# EAGLE design riffleito-REVE (EAGLE 6.5.0)
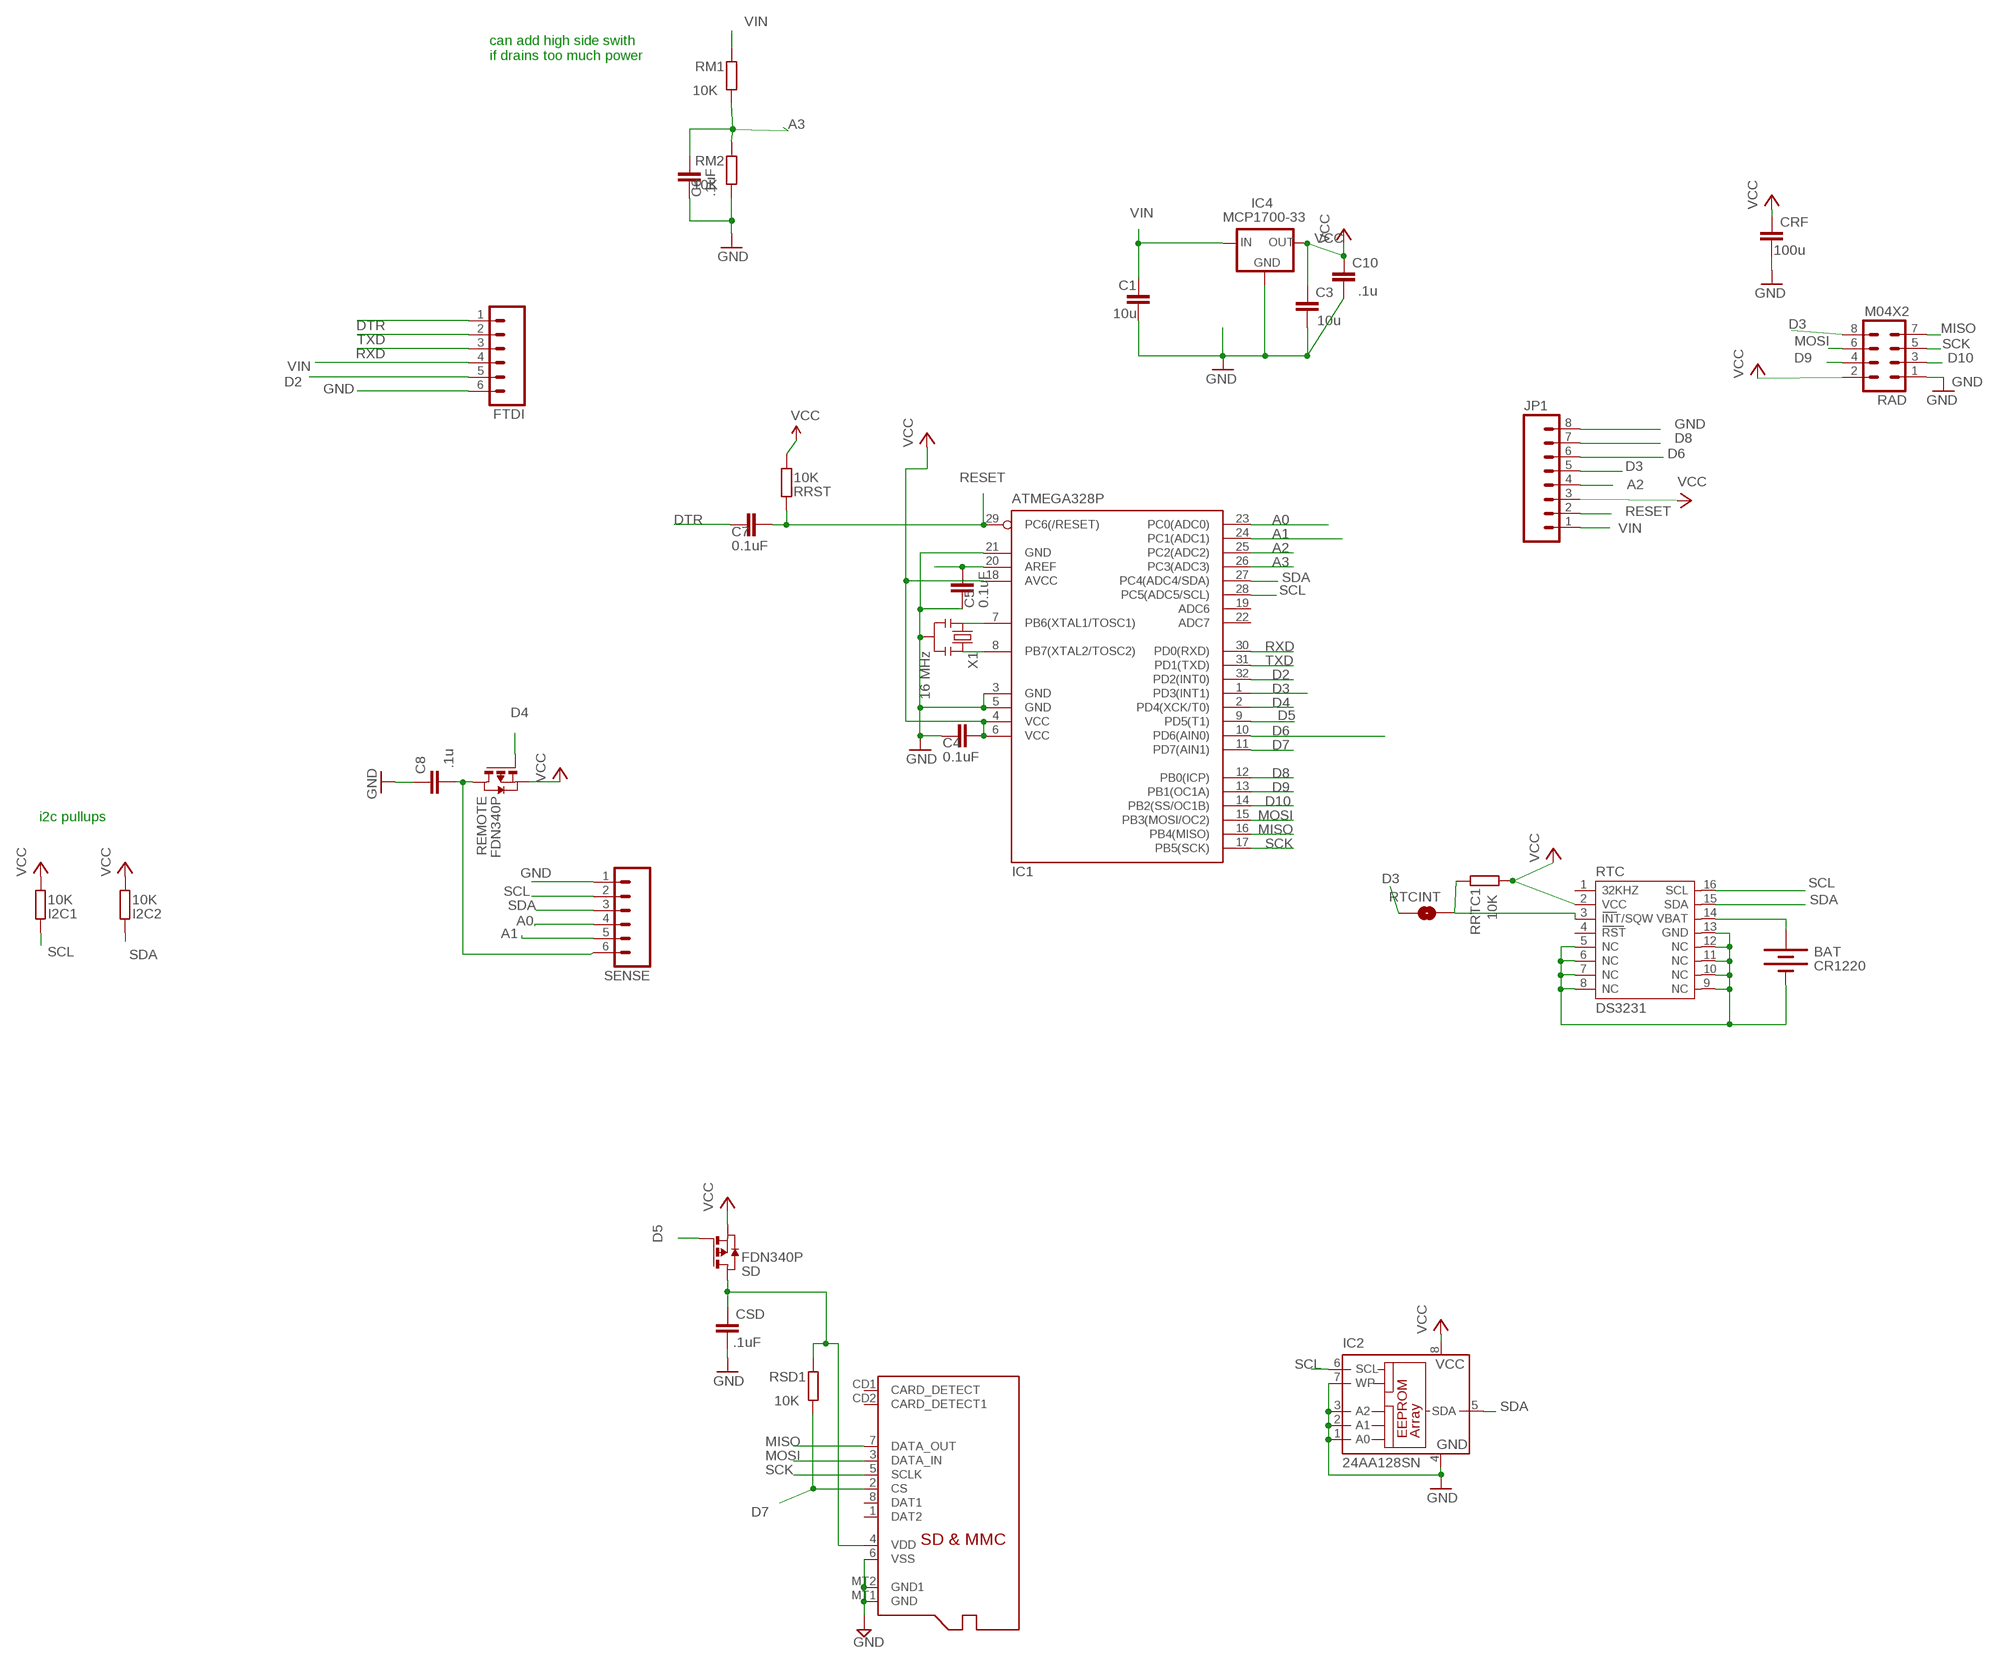
[diagram p0: schematic, sheet 1]

## Parts
BAT  CR1220  BATTERYBATTERY_12MM_SMT  [BATTCON_12MM_SMT]
C1  10u  C-EUC0805  [C0805]
C3  10u  C-EUC0805  [C0805]
C4  0.1uF  C-EUC0805  [C0805@1]
C5  0.1uF  C-EUC0805  [C0805@1]
C6  .1uF  C-EUC0805  [C0805@1]
C7  0.1uF  C-EUC0805  [C0805@1]
C8  .1u  C-EUC0805  [C0805]
C10  .1u  C-EUC0805  [C0805]
CRF  100u  C-EUC0805  [C0805]
CSD  .1uF  C-EUC0805  [C0805]
FTDI  M06SIP  [1X06]
I2C1  10K  R-EU_R0805  [R0805]
I2C2  10K  R-EU_R0805  [R0805]
IC1  ATMEGA328P  MEGA8-AI  [TQFP32-08]
IC2  24AA128SN  [SO-08]
IC4  MCP1700-33  MCP1700SOT233  [SOT23]
JP1  M081X08  [1X08]
MICROSD  MICROSD  [MICROSD]
RAD  M04X2  [2X4]
REMOTE  FDN340P  PMOSSOT23  [SOT-23]
RM1  10K  R-EU_R0805  [R0805]
RM2  10K  R-EU_R0805  [R0805]
RRST  10K  R-EU_R0805  [R0805]
RRTC1  10K  R-EU_R0805  [R0805]
RSD1  10K  R-EU_R0805  [R0805]
RTC  DS3231  [DS3231]
RTCINT  SOLDERJUMPERNO  [SJ_2S-NO]
SD  FDN340P  PMOSSOT23  [SOT-23]
SENSE  M06SIP  [1X06]
X1  16 MHz  RESONATORSMD  [RESONATOR-SMD]

## Nets
A0: IC1.23(PC0(ADC0)) SENSE.4
A1: IC1.24(PC1(ADC1)) SENSE.5
A2: IC1.25(PC2(ADC2)) JP1.4
A3: C6.2 IC1.26(PC3(ADC3)) RM1.1 RM2.2
AREF: C5.2 IC1.20(AREF)
D2: FTDI.5 IC1.32(PD2(INT0))
D3: IC1.1(PD3(INT1)) JP1.5 RAD.8 RTCINT.2
D4: IC1.2(PD4(XCK/T0)) REMOTE.3(G)
D5: IC1.9(PD5(T1)) SD.3(G)
D6: IC1.10(PD6(AIN0)) JP1.6
D7: IC1.11(PD7(AIN1)) MICROSD.2(CS) RSD1.1
D8: IC1.12(PB0(ICP)) JP1.7
D9: IC1.13(PB1(OC1A)) RAD.4
D10: IC1.14(PB2(SS/OC1B)) RAD.3
DTR: C7.1 FTDI.1
GND: BAT.P$1(-) C1.2 C3.2 C4.1 C5.1 C6.1 C8.1 C10.2 CRF.2 CSD.2 FTDI.6 IC1.3(GND) IC1.5(GND) IC1.21(GND) IC2.1(A0) IC2.2(A1) IC2.3(A2) IC2.4(GND) IC2.7(WP) IC4.1(GND) JP1.8 MICROSD.6(VSS) MICROSD.MT1(GND) MICROSD.MT2(GND1) RAD.1 RM2.1 RTC.5(NC) RTC.6(NC) RTC.7(NC) RTC.8(NC) RTC.9(NC) RTC.10(NC) RTC.11(NC) RTC.12(NC) RTC.13(GND) SENSE.1 X1.2
MISO: IC1.16(PB4(MISO)) MICROSD.7(DATA_OUT) RAD.7
MOSI: IC1.15(PB3(MOSI/OC2)) MICROSD.3(DATA_IN) RAD.6
N$1: RRTC1.2 RTC.3(INT/SQW) RTCINT.1
N$2: IC1.8(PB7(XTAL2/TOSC2)) X1.3
N$3: IC1.7(PB6(XTAL1/TOSC1)) X1.1
RESET: C7.2 IC1.29(PC6(/RESET)) JP1.2 RRST.2
RTC_BATT: BAT.P$2(+) RTC.14(VBAT)
RXD: FTDI.3 IC1.30(PD0(RXD))
SCK: IC1.17(PB5(SCK)) MICROSD.5(SCLK) RAD.5
SCL: I2C1.2 IC1.28(PC5(ADC5/SCL)) IC2.6(SCL) RTC.16(SCL) SENSE.2
SDA: I2C2.2 IC1.27(PC4(ADC4/SDA)) IC2.5(SDA) RTC.15(SDA) SENSE.3
TXD: FTDI.2 IC1.31(PD1(TXD))
VCC: C3.1 C4.2 C8.2 C10.1 CRF.1 I2C1.1 I2C2.1 IC1.4(VCC) IC1.6(VCC) IC1.18(AVCC) IC2.8(VCC) IC4.2(OUT) JP1.3 RAD.2 REMOTE.1(D) REMOTE.2(S) RRST.1 RRTC1.1 RTC.2(VCC) SD.2(S) SENSE.6
VDD: CSD.1 MICROSD.4(VDD) RSD1.2 SD.1(D)
VIN [power]: C1.1 FTDI.4 IC4.3(IN) JP1.1 RM1.2
Unconnected: IC1.19(ADC6) IC1.22(ADC7) MICROSD.1(DAT2) MICROSD.8(DAT1) MICROSD.CD1(CARD_DETECT) MICROSD.CD2(CARD_DETECT1) RTC.1(32KHZ) RTC.4(RST)

## Notes on the sheet
- can add high side swith
  if drains too much power
- i2c pullups

## Library data of the parts
BAT = SparkFunNew:BATTERY: Battery Holders Various common sizes : AA, AAA, 20mm coin cell and 12mm coin cell.
C1 C3 C8 C10 CRF CSD = resistor:C-EU: CAPACITOR, European symbol
C4-C7 = rcl:C-EU: CAPACITOR, European symbol
FTDI SENSE = SparkFun-Connectors:M06: Header 6 Standard 6-pin 0.1" header. Use with straight break away headers (SKU : PRT-00116), right angle break away headers (PRT-00553), swiss pins (PRT-00743), machine pins (PRT-00117), and female headers (PRT-00115). Molex polarized connector foot print use with SKU : PRT-08094 with associated crimp pins and housings. NOTES ON THE VARIANTS LOCK and LOCK_LONGPADS... This footprint was designed to help hold the alignment of a through-hole component (i.e. 6-pin header) while soldering it into place. You may notice that each hole has been shifted either up or down by 0.005 of an inch from it's more standard position (which is a perfectly straight line). This slight alteration caused the pins (the squares in the middle) to touch the edges of the holes. Because they are alternating, it causes a "brace" to hold the component in place. 0.005 has proven to be the perfect amount of "off-center" position when using our standard breakaway headers. Although looks a little odd when you look at the bare footprint, once you have a header in there, the alteration is very hard to notice. Also,if you push a header all the way into place, it is covered up entirely on the bottom side. This idea of altering the position of holes to aid alignment will be further integrated into the Sparkfun Library for other footprints. It can help hold any component with 3 or more connection pins.
I2C1 I2C2 RM1 RM2 RRST RRTC1 RSD1 = rcl:R-EU_: RESISTOR, European symbol
IC1 = atmel:MEGA8: MICROCONTROLLER 8 Kbytes FLASH, 1 kbytes SRAM, 512 bytes EEPROM, USART, 6-channel 10 bit ADC, 2-channel 8 bit ADC Pin compatible with Atmega48, ATMega88, ATMega168 Source: avr.lbr; MPN: ATMEGA8-16AU; OC_FARNELL: 9171371; OC_NEWARK: 73M8863
IC2 = microchip:24*: Serial EEPROM I2C; MF: MICROCHIP; MPN: 24AA128-I/SN; OC_FARNELL: unknown; OC_NEWARK: 92C6842
IC4 = adafruit:MCP1700: VOLTAGE REGULATOR
JP1 = SparkFun-Connectors:M08: Header 8 Standard 8-pin 0.1" header. Use with straight break away headers (SKU : PRT-00116), right angle break away headers (PRT-00553), swiss pins (PRT-00743), machine pins (PRT-00117), and female headers (PRT-00115).
MICROSD = adafruit:MICROSD: Micro-SD / Transflash card holder with SPI pinout For the 3M # 2908-05WB-MG and/or 4UCON #19656 push-push type
RAD = SparkFun-Connectors:M04X2: .1" header, two rows of four.
REMOTE SD = zetex:PMOSSOT23: MOS FET
RTC = _lh-library:DS3231
RTCINT = _SparkFun:SOLDERJUMPER: Solder Jumper Standard SMD solder jumper. Used to automate production. Two varients : Normally Open and Normally Closed are the same, but have different paste layers. NC will have a large amount of paste and should jumper during reflow.
X1 = SparkFun:RESONATOR: Resonator Small SMD resonator. This is the itty bitty 10/20MHz resonators with built in caps. CSTCE10M0G55 and CSTCE20M0V53. Footprint has been reviewed closely but hasn't been tested yet.

## Net classes
0 default: width 0.203 mm, drill 0.33 mm, clearance 0.203 mm
1 power: width 0.381 mm, drill 0.33 mm, clearance 0.254 mm

## Board
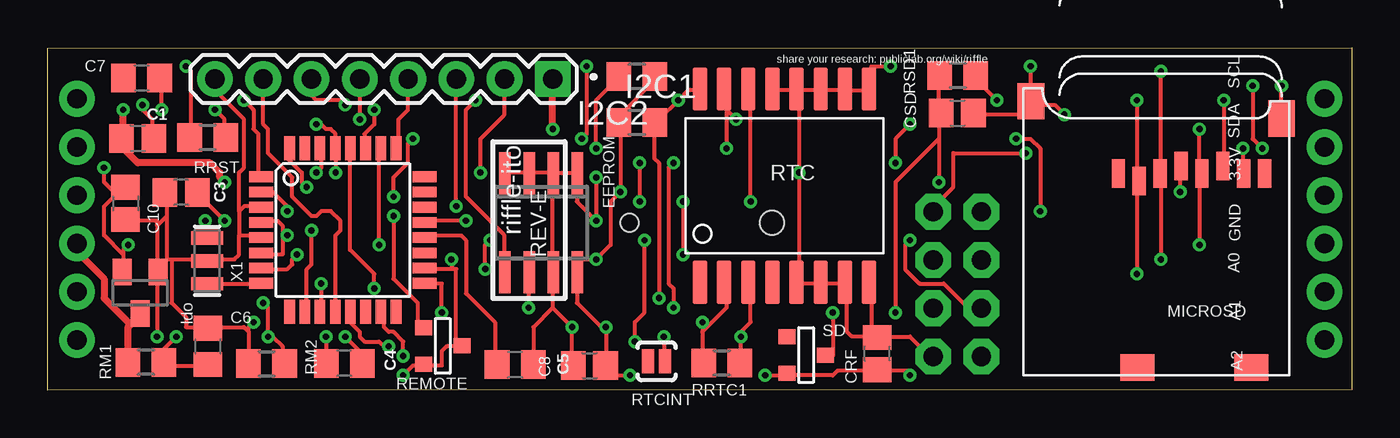
[diagram p1: board, top side]
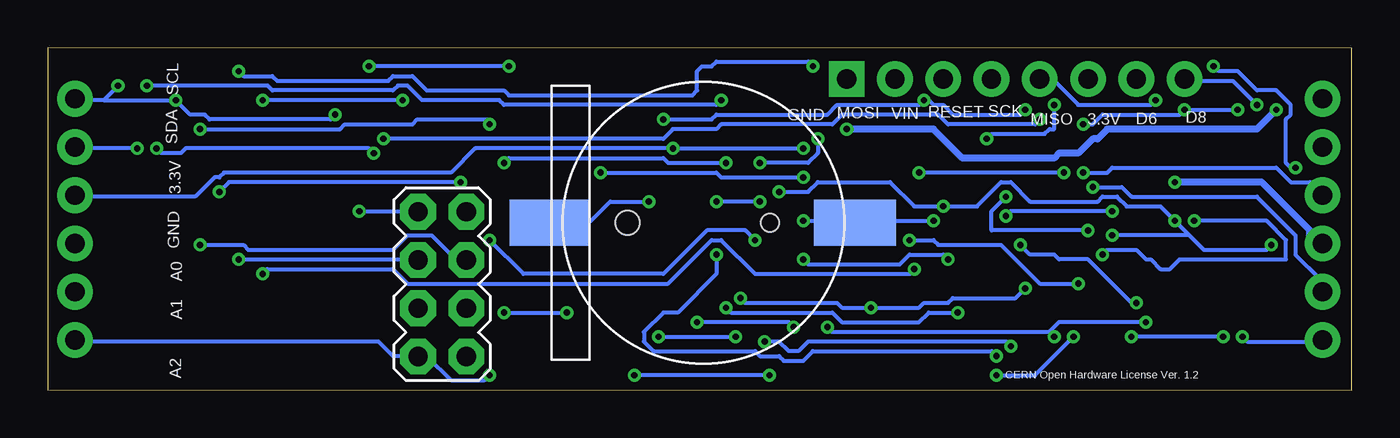
[diagram p2: board, bottom side, seen from below]

Size 68.66 x 18.03 mm. Coordinates in mm from the lower left corner, seen from the top.
Outline: 0,0 0,18.01 68.66,18.03 68.66,0.03 0,0
Copper layers (1*16): Top 0.0356mm / dielectric 1.5011mm / Bottom 0.0356mm
Design rules "LaenPCBOrder": minimum track width 6mil, minimum drill 13mil, track to track 6mil, track to pad 6mil, pad to pad 6mil, via to via 6mil, smd to smd 6mil, copper to edge 15mil, drill to drill 6mil, minimum pad ring 7mil, minimum via ring 7mil, stop-mask expansion 3mil, vias tented up to drill 0mil, thermal gap 10mil

### Footprints (pad centres in the part's own frame; a part is rotated, then mirrored left to right if it is on the bottom)
BATTCON_12MM_SMT = smd 2.4 x 4.3: P$1 0,11.96 | smd 2.4 x 4.2: P$2 0,-4.1 | hole 0.95: 0,7.5 | hole 1.25: 0,0
C0805 = smd 1.3 x 1.5: 1 -0.85,0; 2 0.85,0
C0805@1 = smd 1.3 x 1.5: 1 -0.95,0; 2 0.95,0
1X06 = drill 1.016 pad 1.88: 1 0,0; 2 2.54,0; 3 5.08,0; 4 7.62,0; 5 10.16,0; 6 12.7,0
R0805 = smd 1.3 x 1.5: 1 -0.95,0; 2 0.95,0
TQFP32-08 = smd 1.27 x 0.559: 1 -4.293,2.8; 2 -4.293,2; 3 -4.293,1.2; 4 -4.293,0.4; 5 -4.293,-0.4; 6 -4.293,-1.2; 7 -4.293,-2; 8 -4.293,-2.8; 17 4.293,-2.8; 18 4.293,-2; 19 4.293,-1.2; 20 4.293,-0.4; 21 4.293,0.4; 22 4.293,1.2; 23 4.293,2; 24 4.293,2.8 | smd 0.559 x 1.27: 9 -2.8,-4.293; 10 -2,-4.293; 11 -1.2,-4.293; 12 -0.4,-4.293; 13 0.4,-4.293; 14 1.2,-4.293; 15 2,-4.293; 16 2.8,-4.293; 25 2.8,4.293; 26 2,4.293; 27 1.2,4.293; 28 0.4,4.293; 29 -0.4,4.293; 30 -1.2,4.293; 31 -2,4.293; 32 -2.8,4.293
SO-08 = smd 0.6 x 2.2: 1 -1.905,-2.6; 2 -0.635,-2.6; 3 0.635,-2.6; 4 1.905,-2.6; 5 1.905,2.6; 6 0.635,2.6; 7 -0.635,2.6; 8 -1.905,2.6
SOT23 = smd 1 x 1.4: 1 -0.95,-1.1; 2 0.95,-1.1; 3 0,1.1
1X08 = drill 1.016 pad 1.88 square: 1 0,0 | drill 1.016 pad 1.88: 2 2.54,0; 3 5.08,0; 4 7.62,0; 5 10.16,0; 6 12.7,0; 7 15.24,0; 8 17.78,0
MICROSD = smd 0.7 x 1.5: 1 9,-10.64; 2 7.9,-10.24; 3 6.8,-10.64; 4 5.7,-11.04; 5 4.6,-10.64; 6 3.5,-11.04; 7 2.4,-10.64; 8 1.3,-10.64 | smd 1.8 x 1.4: CD1 2,-0.44; CD2 8,-0.44 | smd 1.4 x 1.9: MT1 0.4,-13.54; MT2 13.6,-14.44
2X4 = drill 1.016 pad 1.88 octagon: 1 -3.81,-1.27; 2 -3.81,1.27; 3 -1.27,-1.27; 4 -1.27,1.27; 5 1.27,-1.27; 6 1.27,1.27; 7 3.81,-1.27; 8 3.81,1.27
SOT-23 = smd 0.787 x 0.889: 1 0.025,-1.016; 2 -0.94,1.016; 3 0.991,1.016
DS3231 = smd 0.762 x 2.286: 1 -4.445,-5.08; 2 -3.175,-5.08; 3 -1.905,-5.08; 4 -0.635,-5.08; 5 0.635,-5.08; 6 1.905,-5.08; 7 3.175,-5.08; 8 4.445,-5.08; 9 4.445,5.08; 10 3.175,5.08; 11 1.905,5.08; 12 0.635,5.08; 13 -0.635,5.08; 14 -1.905,5.08; 15 -3.175,5.08; 16 -4.445,5.08
SJ_2S-NO = smd 0.635 x 1.27: 1 -0.45,0; 2 0.45,0
RESONATOR-SMD = smd 0.7 x 1.7: 1 -1.2,0; 2 0,0; 3 1.2,0

### Placement (x,y rotation side)
BAT  38.13,8.81 270 bottom
C1  4.75,13.26 0 top
C3  7.04,10.41 180 top
C4  15.62,1.42 180 top
C5  24.61,1.35 180 top
C6  8.43,2.31 270 top
C7  4.95,16.43 0 top
C8  28.52,1.3 0 top
C10  4.11,9.83 270 top
CRF  43.66,1.93 90 top
CSD  47.88,14.58 0 top
FTDI  1.55,15.34 270 top
I2C1  31.01,14.1 0 top
I2C2  31.01,16.51 180 top
IC1  15.54,8.43 0 top
IC2  25.98,8.81 180 top
IC4  4.88,5.13 180 top
JP1  26.59,16.38 180 top
MICROSD  65.35,0.76 180 top
RAD  47.88,5.59 90 bottom
REMOTE  20.8,2.31 90 top
RM1  5.18,1.47 180 top
RM2  11.53,1.4 0 top
RRST  8.43,13.31 0 top
RRTC1  35.48,1.45 0 top
RSD1  47.9,16.56 180 top
RTC  38.79,10.77 0 top
RTCINT  32.05,1.52 180 top
SD  39.93,1.83 90 top
SENSE  67.21,15.34 270 top
X1  8.41,6.81 270 top

### Tracks (layer width: path | path; a pad name or v marks a point on that pad's centre or on a via)
A2
  Top 0.203: JP1.4 18.97,14.76 18.47,14.25 18.47,12.73 IC1.25
A3  (via drill 0.33)
  Top 0.203: v6.78,2.82 6.02,2.06 6.02,1.55 RM1.1 6.27,1.3 8.31,1.3 C6.2 | RM2.2 12.37,1.55 12.37,2.31 11.86,2.82 v11.61,2.82 11.61,4.34 v11.35,4.6 | v17.45,7.65 17.45,12.73 IC1.26
  Bottom 0.203: v6.78,2.82 v11.61,2.82 | v17.45,7.65 16.94,7.14 15.67,7.14 15.42,6.88 13.89,6.88 11.61,4.6 v11.35,4.6
AREF
  Top 0.203: C5.2 23.55,1.55 23.55,3.58 22.02,5.11 22.02,7.9 21.77,8.15 19.99,8.15 IC1.20
D2  (via drill 0.33)
  Top 0.203: v13.64,10.69 13.39,10.95 13.39,11.46 12.62,12.22 12.62,12.73 IC1.32
  Bottom 0.203: v13.64,10.69 12.12,10.69 11.61,10.19 5,10.19 2.97,8.15 2.97,7.14 1.7,5.87 1.7,5.36 FTDI.5
D3  (via drill 0.33)
  Top 0.203: v52.25,9.42 52.25,12.73 51.74,13.23 v50.98,13.23 | JP1.5 v16.43,14.25 | v10.34,15.27 10.85,14.76 10.85,13.74 11.1,13.49 11.1,11.46 IC1.1
  Bottom 0.203: v52.25,9.42 49.2,9.42 RAD.8 | v50.98,13.23 36.25,13.23 35.74,13.74 33.45,13.74 33.2,14 27.36,14 26.85,14.5 21.77,14.5 21.26,14 16.69,14 v16.43,14.25 | v10.34,15.27 10.59,15.01 14.4,15.01 15.67,16.28 16.43,16.28 JP1.5
D4  (via drill 0.33)
  Top 0.203: v18.21,9.17 18.21,5.87 19.48,4.6 19.48,3.33 19.74,3.33 REMOTE.3 | v12.62,9.42 12.62,9.68 11.86,10.44 11.35,10.44 IC1.2
  Bottom 0.203: v18.21,9.17 17.96,9.42 v12.62,9.42
D6  (via drill 0.33)
  Top 0.203: JP1.6 13.89,15.52 14.15,15.27 15.67,15.27 v15.67,15.01 | v19.23,13.23 18.97,12.98 18.97,11.96 18.21,11.2 v18.21,10.19 | v13.89,8.41 13.89,6.63 13.64,6.38 13.64,4.34 IC1.10
  Bottom 0.203: v15.67,15.01 15.67,13.74 15.93,13.74 16.18,13.49 18.97,13.49 v19.23,13.23 | v18.21,10.19 18.97,9.42 18.97,8.41 v13.89,8.41
D7  (via drill 0.33)
  Top 0.203: v57.33,15.27 57.33,11.2 MICROSD.2 57.33,10.95 v57.33,6.12 | v49.96,15.27 48.95,16.28 48.95,16.54 RSD1.1 | v14.4,5.61 14.4,4.34 IC1.11 | v23.29,7.9 23.04,7.65 v23.04,6.38
  Bottom 0.203: v49.96,15.27 v57.33,15.27 | v14.4,5.61 16.43,5.61 18.47,7.65 21.77,7.65 22.02,7.9 v23.29,7.9 | v23.04,6.38 23.29,6.12 31.42,6.12 33.2,7.9 33.71,7.9 35.99,5.61 49.71,5.61 50.47,6.38 57.07,6.38 v57.33,6.12
D8
  Top 0.203: JP1.7 11.35,14 11.61,13.74 11.61,12.47 12.88,11.2 12.88,10.19 13.89,9.17 14.15,9.17 14.4,9.42 14.91,9.42 15.42,8.92 15.42,8.41 15.16,8.15 15.16,4.34 IC1.12
D9  (via drill 0.33)
  Top 0.203: v45.39,7.9 45.14,7.65 45.14,6.38 45.9,5.61 47.17,5.61 48.44,4.34 48.95,4.34 RAD.4 | v31.42,7.9 31.42,4.09 30.91,3.58 v30.91,2.57 | v17.96,2.31 17.7,2.31 17.45,2.57 16.69,2.57 16.43,2.82 16.43,3.07 15.93,3.58 15.93,4.09 IC1.13
  Bottom 0.203: v45.39,7.9 43.61,6.12 36.25,6.12 33.96,8.41 31.93,8.41 v31.42,7.9 | v30.91,2.57 30.15,2.57 29.64,2.06 29.13,2.06 28.63,2.57 18.21,2.57 v17.96,2.31
GND  (via drill 0.33)
  Top 0.203: v15.67,2.82 16.43,2.06 16.43,1.55 C4.1 | C8.1 27.61,1.3 v27.61,3.33 26.59,4.34 | 19.74,8.92 IC1.21 19.99,8.92 v22.02,8.92 | 24.05,11.46 IC2.4 24.31,11.46 25.32,11.46 IC2.3 25.58,11.46 26.59,11.46 IC2.2 | 26.59,4.34 25.58,3.33 25.58,1.55 C5.1 | 26.59,4.34 26.59,6.12 IC2.7 26.59,6.38 26.59,11.2 IC2.2 | IC2.2 26.85,11.46 27.86,11.46 IC2.1 27.86,11.2 27.86,9.93 v28.88,8.92 v28.88,11.2 | v5,15.01 5,14.76 5.51,14.25 5.51,13.49 C1.2 | 10.59,3.07 10.59,1.55 RM2.1 | 10.59,3.07 10.34,3.33 8.56,3.33 C6.1 8.31,3.33 7.29,3.33 7.29,3.84 6.53,4.6 6.53,6.88 | 10.08,8.15 11.1,8.15 IC1.5 | 10.08,9.42 10.08,8.15 | 10.08,9.42 10.34,9.68 11.1,9.68 IC1.3 | 5.77,8.66 5.77,6.38 IC4.1 5.77,6.12 v5.77,2.82 | 6.27,9.17 5.77,8.66 | 6.27,9.17 6.27,10.19 C3.2 | 5.77,8.66 5.77,8.92 4.24,8.92 C10.2 | 6.53,6.88 6.27,6.88 6.27,9.17 | 6.53,6.88 8.31,6.88 X1.2 8.56,6.88 9.83,6.88 10.08,7.14 10.08,8.15 | JP1.8 8.81,15.77 10.34,14.25 10.34,11.71 10.08,11.46 10.08,9.42 | v10.85,3.58 10.59,3.33 10.59,3.07 | 43.36,2.82 43.61,2.82 CRF.2 | 43.36,2.82 43.36,5.61 RTC.8 | 43.36,2.82 42.34,2.82 42.09,3.07 42.09,5.61 RTC.7 41.83,5.61 40.82,5.61 RTC.6 40.56,5.61 39.55,5.61 RTC.5 39.55,5.87 v39.55,11.46 39.55,15.77 | 43.36,2.82 CRF.2 | RAD.1 46.41,1.8 45.39,2.82 43.87,2.82 CRF.2 | v64.95,16.03 64.95,14.5 MICROSD.MT1 | v61.9,15.27 61.9,11.96 MICROSD.6 | CSD.2 48.95,14.5 51.74,14.5 51.74,15.01 MICROSD.MT2 | RTC.13 38.28,15.77 39.29,15.77 RTC.12 39.55,15.77 | 39.55,15.77 40.56,15.77 RTC.11 40.82,15.77 41.83,15.77 RTC.10 42.09,15.77 43.1,15.77 RTC.9 43.36,16.03 43.36,17.04 v44.37,17.04 | v51.74,17.04 51.74,15.27 MICROSD.MT2
  Top 0.203: v53.52,14.5 53.01,15.01 51.99,15.01 MICROSD.MT2
  Bottom 0.203: 15.93,3.07 v15.67,2.82 | 15.93,3.07 27.36,3.07 v27.61,3.33 | v22.02,8.92 26.09,8.92 BAT.P$1 26.34,8.92 v28.88,8.92 | v5,15.01 6.27,16.28 8.81,16.28 JP1.8 | v5.77,2.82 5.51,2.57 1.7,2.57 FTDI.6 | 15.93,3.07 15.42,3.58 v10.85,3.58 | 65.71,15.27 66.98,15.27 SENSE.1 | v64.95,16.03 65.71,15.27 | 65.71,15.27 v61.9,15.27 61.14,14.5 60.38,14.5 60.12,14.25 53.77,14.25 v53.52,14.5 | v44.37,17.04 v51.74,17.04 | v28.88,11.2 33.2,11.2 33.45,11.46 v39.55,11.46
MISO  (via drill 0.33)
  Top 0.203: v62.92,12.73 62.92,11.46 MICROSD.7 | v51.49,12.47 47.68,12.47 47.68,10.69 46.66,9.68 46.66,9.42 RAD.7
  Bottom 0.203: v62.92,12.73 62.66,12.47 61.65,12.47 61.39,12.73 51.74,12.73 v51.49,12.47
MOSI  (via drill 0.33)
  Top 0.203: v58.6,6.88 58.6,11.2 MICROSD.3 58.6,11.46 v58.6,16.79 | v18.72,1.8 18.72,2.57 18.21,3.07 17.96,3.07 17.7,3.33 17.7,4.09 IC1.15 | v33.45,9.93 v33.45,7.14 | v31.17,11.96 v31.17,9.93 | v28.12,13.23 28.37,13.49 v28.37,17.04
  Bottom 0.203: v58.6,6.88 49.2,6.88 RAD.6 | v18.72,1.8 18.97,2.06 28.37,2.06 28.88,1.55 29.9,1.55 30.15,1.8 31.17,1.8 31.42,2.06 36.75,2.06 37.26,2.57 37.26,3.07 36.25,4.09 35.48,4.09 33.45,6.12 v33.45,7.14 | v31.17,9.93 v33.45,9.93 | v31.17,11.96 28.63,11.96 28.12,12.47 v28.12,13.23 | v28.37,17.04 28.63,17.3 33.45,17.3 33.71,17.04 34.21,17.04 34.47,16.79 34.47,15.77 34.72,15.52 44.37,15.52 44.63,15.77 48.69,15.77 49.45,16.54 50.47,16.54 50.72,16.28 56.57,16.28 56.82,16.54 58.34,16.54 v58.6,16.79
N$1  (via drill 0.33)
  Top 0.203: v32.44,2.82 32.44,1.55 RTCINT.1 | RRTC1.2 36.5,1.55 v36.5,2.82 36.5,3.07 37.01,3.58 37.01,5.61 RTC.3
  Bottom 0.203: v36.5,2.82 v32.44,2.82
N$2
  Top 0.203: IC1.8 11.1,5.61 8.56,5.61 X1.3
N$3  (via drill 0.33)
  Top 0.203: v8.31,8.92 8.31,8.15 X1.1 | v13.13,7.14 12.88,6.88 12.88,6.63 12.62,6.38 11.35,6.38 IC1.7
  Bottom 0.203: v8.31,8.92 4.5,8.92 3.48,7.9 3.48,6.88 9.07,6.88 9.58,6.38 10.08,6.38 10.59,6.88 10.85,6.88 11.35,7.39 12.88,7.39 v13.13,7.14
RESET  (via drill 0.33)
  Top 0.203: v6.02,14.76 6.02,16.28 C7.2 | v8.81,14.76 9.32,14.25 9.32,13.49 RRST.2 | JP1.2 24.05,14.5 22.78,13.23 v22.78,11.46 | 15.16,12.73 v15.16,11.46 | v14.15,14 14.4,14 14.66,13.74 14.91,13.74 15.16,13.49 15.16,12.73 | 15.16,12.73 IC1.29
  Bottom 0.203: v6.02,14.76 v8.81,14.76 9.07,14.5 13.13,14.5 13.64,14 v14.15,14 | v15.16,11.46 v22.78,11.46
RTC_BATT  (via drill 0.33)
  Top 0.203: v37.01,9.93 37.01,15.77 RTC.14
  Bottom 0.203: v37.01,9.93 39.04,9.93 40.06,8.92 42.09,8.92 BAT.P$2
RXD  (via drill 0.33)
  Top 0.203: v14.15,11.46 14.4,11.71 14.4,12.73 IC1.30
  Bottom 0.203: v14.15,11.46 12.88,11.46 12.62,11.71 3.99,11.71 3.23,10.95 2.21,10.95 1.7,10.44 FTDI.3
SCK  (via drill 0.33)
  Top 0.203: v60.63,7.65 60.63,11.2 MICROSD.5 60.63,11.46 v60.63,13.74 | v20.75,4.09 20.75,5.61 19.99,5.61 IC1.17 | v32.94,4.34 32.94,5.36 32.69,5.61 32.69,11.71 v32.94,11.96 | v44.63,11.96 44.63,13.23 v45.39,14
  Bottom 0.203: v60.63,7.65 58.34,7.65 58.09,7.39 50.47,7.39 49.71,8.15 48.44,8.15 47.17,6.88 46.66,6.88 RAD.5 | v20.75,4.09 22.28,4.09 22.78,3.58 26.85,3.58 27.36,4.09 32.69,4.09 v32.94,4.34 | v32.94,11.96 35.99,11.96 36.25,12.22 44.37,12.22 v44.63,11.96 | v45.39,14 45.39,14.25 49.2,14.25 49.45,14 53.01,14 53.26,13.74 v60.63,13.74
SCL  (via drill 0.33)
  Top 0.203: v17.2,5.36 17.2,6.12 15.93,7.39 15.93,12.73 IC1.28 | v25.32,4.34 25.32,6.12 IC2.6 | v63.93,12.73 63.42,13.23 v63.42,16.03 | RTC.16 34.21,15.77 33.71,15.77 v33.2,15.27 32.18,14.25 I2C1.2 31.93,14 31.93,12.22 32.18,11.96 v32.18,4.85
  Bottom 0.203: v17.2,5.36 17.7,4.85 21.01,4.85 21.26,4.6 22.53,4.6 22.78,4.34 v25.32,4.34 26.85,4.34 27.1,4.6 31.93,4.6 v32.18,4.85 | v63.93,12.73 66.98,12.73 SENSE.2 | v63.42,16.03 57.07,16.03 56.82,15.77 50.47,15.77 50.22,16.03 49.71,16.03 48.95,15.27 44.88,15.27 44.63,15.01 33.45,15.01 v33.2,15.27
SDA  (via drill 0.33)
  Top 0.203: v17.2,14.76 17.2,14 16.69,13.49 16.69,12.73 IC1.27 | v22.53,15.27 22.02,14.76 22.02,10.19 24.05,8.15 24.05,6.38 IC2.5 | 35.74,14.76 35.74,15.77 RTC.15 35.74,14.76 | 35.74,14.76 v35.74,12.73 | v28.88,12.73 28.88,15.27 29.9,16.28 I2C2.2 | 35.74,14.76 v36.25,14.25
  Bottom 0.203: v17.2,14.76 17.45,14.5 21.01,14.5 21.51,15.01 22.02,15.01 22.28,15.27 v22.53,15.27 22.78,15.01 27.1,15.01 27.61,14.5 33.45,14.5 33.71,14.25 v36.25,14.25 | SENSE.3 66.98,10.19 60.88,10.19 59.87,11.2 59.61,11.2 59.36,11.46 47.42,11.46 46.15,12.73 v35.74,12.73 v28.88,12.73
VCC  (via drill 0.33)
  Top 0.203: v45.39,0.79 45.39,1.04 43.87,1.04 CRF.1 43.61,1.04 41.58,1.04 41.33,0.79 39.04,0.79 SD.2 38.79,0.79 v37.77,0.79 | 21.51,2.31 21.77,2.31 REMOTE.1 21.51,2.31 | 21.51,2.31 21.01,2.31 20.75,2.06 20.75,1.3 19.99,1.3 REMOTE.2 19.74,1.3 19.23,1.3 v18.72,0.79 | 21.26,6.38 21.51,6.38 21.51,2.31 | 21.26,6.38 19.99,6.38 IC1.18 | v14.66,2.82 14.66,1.55 C4.2 | 34.47,3.07 34.47,1.55 RRTC1.1 | 34.47,3.07 35.74,4.34 35.74,5.61 RTC.2 | 29.39,3.07 29.39,1.3 | 29.39,3.07 27.86,4.6 27.86,6.12 IC2.8 27.86,6.38 27.86,6.88 v28.88,6.88 29.64,7.65 29.64,9.93 v30.15,10.44 30.15,14 I2C1.1 30.15,14.25 30.15,14.5 31.93,16.28 I2C2.1 | v34.47,3.58 34.47,3.07 | 29.39,3.07 v29.39,3.33 | v21.26,6.88 21.26,6.38 | 12.37,8.15 12.37,8.66 12.12,8.92 11.35,8.92 IC1.4 | 12.37,8.15 12.37,7.14 11.35,7.14 IC1.6 | 3.99,7.14 3.99,7.39 v4.24,7.65 | 3.99,7.14 3.99,6.38 IC4.2 | v9.32,8.92 8.05,10.19 C3.1 | 3.48,10.44 3.48,10.19 2.97,9.68 2.97,8.15 3.99,7.14 | 3.48,10.44 3.48,10.69 3.99,10.69 C10.1 3.48,10.44 | v7.29,17.04 7.54,16.79 7.54,13.49 RRST.1 | v2.97,11.71 2.97,10.95 3.48,10.44 | v12.62,8.15 12.37,8.15 | v21.51,9.68 JP1.3 | v30.66,0.79 29.39,0.79 29.39,1.3 | 29.39,1.3 C8.2
  Bottom 0.203: v45.39,0.79 45.64,0.53 47.42,0.53 48.69,1.8 48.95,1.8 RAD.2 49.2,1.8 50.47,1.8 51.23,2.57 66.98,2.57 SENSE.6 | v14.66,2.82 16.69,0.79 v18.72,0.79 | v34.47,3.58 29.64,3.58 v29.39,3.33 | v21.26,6.88 21.51,7.14 23.29,7.14 23.8,6.63 28.63,6.63 v28.88,6.88 | v4.24,7.65 4.5,7.39 7.8,7.39 8.56,8.15 | 8.56,8.15 v9.32,8.92 10.08,9.68 11.86,9.68 12.37,10.19 13.13,10.19 13.39,9.93 16.94,9.93 17.96,10.95 18.47,10.95 19.74,9.68 v21.51,9.68 23.04,9.68 24.31,10.95 28.12,10.95 28.63,10.44 v30.15,10.44 | v7.29,17.04 7.04,16.79 6.02,16.79 5,15.77 3.99,15.77 3.23,15.01 3.23,14.5 3.48,14.25 3.48,11.96 3.23,11.71 v2.97,11.71 | 8.56,8.15 v12.62,8.15 | v30.66,0.79 v37.77,0.79
VDD  (via drill 0.33)
  Top 0.203: RSD1.2 46.91,16.54 46.91,14.76 CSD.1 46.91,14.5 46.91,13.23 | v41.33,4.09 41.33,1.8 41.07,1.8 SD.1 | v44.63,4.09 44.63,10.95 46.91,13.23 | v59.61,10.44 59.61,11.71 MICROSD.4 | 46.91,13.23 v46.91,10.95
  Bottom 0.203: v44.63,4.09 v41.33,4.09 | v59.61,10.44 59.11,10.95 v46.91,10.95
VIN  (via drill 0.33)
  Top 0.381: 4.37,3.45 4.24,3.33 4.24,1.55 RM1.2 | 4.37,3.45 4.75,3.84 IC4.3 | v9.32,10.95 9.07,11.2 9.07,11.46 8.56,11.96 4.75,11.96 3.99,12.73 3.99,13.23 C1.1 3.99,13.49 v3.99,14.76 | 4.37,3.45 2.97,4.85 2.97,5.87 1.45,7.39 1.45,7.65 FTDI.4 | v26.59,13.74 JP1.1
  Bottom 0.381: v9.32,10.95 4.75,10.95 2.21,8.41 2.21,7.65 1.7,7.65 FTDI.4 | v26.59,13.74 22.02,13.74 20.5,12.22 15.67,12.22 15.42,12.47 14.4,12.47 13.64,13.23 13.39,13.23 12.88,13.74 5,13.74 v3.99,14.76

### Text on the board
tPlace: share your research: publiclab.org/wiki/riffle | SCL | SDA | riffle-ito | EEPROM | 3.3V | GND | REV-E | A0 | A1 | ldo | A2
bPlace: SCL | D8 | D6 | 3.3V | MISO | RESET | VIN | GND | SDA | SCK | MOSI | 3.3V | GND | A0 | A1 | A2 | CERN Open Hardware License Ver. 1.2